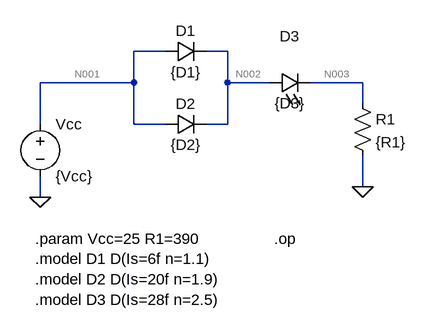
[diagram p0: schematic Lab 01 EaD C.asc]
Lab 01 EaD C.asc, the LTspice schematic file:
Version 4
SHEET 1 880 680
WIRE 144 16 96 16
WIRE 240 16 208 16
WIRE 96 64 96 16
WIRE 96 64 -48 64
WIRE 240 64 240 16
WIRE 304 64 240 64
WIRE 448 64 368 64
WIRE 448 96 448 64
WIRE -48 128 -48 64
WIRE 96 128 96 64
WIRE 144 128 96 128
WIRE 240 128 240 64
WIRE 240 128 208 128
WIRE 448 224 448 176
WIRE -48 240 -48 208
FLAG -48 240 0
FLAG 448 224 0
SYMBOL voltage -48 112 R0
SYMATTR InstName Vcc
SYMATTR Value {Vcc}
SYMBOL diode 144 32 R270
WINDOW 0 32 32 VTop 2
WINDOW 3 0 32 VBottom 2
SYMATTR InstName D1
SYMATTR Value {D1}
SYMBOL diode 144 144 R270
WINDOW 0 32 32 VTop 2
WINDOW 3 0 32 VBottom 2
SYMATTR InstName D2
SYMATTR Value {D2}
SYMBOL LED 304 80 R270
WINDOW 0 72 32 VTop 2
WINDOW 3 0 32 VBottom 2
SYMATTR InstName D3
SYMATTR Value {D3}
SYMBOL res 432 80 R0
SYMATTR InstName R1
SYMATTR Value {R1}
TEXT -56 304 Left 2 !.param Vcc=25 R1=390\n.model D1 D(Is=6f n=1.1)\n.model D2 D(Is=20f n=1.9)\n.model D3 D(Is=28f n=2.5)
TEXT 312 304 Left 2 !.op

The netlist it stands for:
* Lab 01 EaD C.asc
Vcc N001 0 {Vcc}
D1 N001 N002 {D1}
D2 N001 N002 {D2}
D3 N002 N003 {D3}
R1 N003 0 {R1}
.model D D
.lib standard.dio
.param Vcc=25 R1=390
.model D1 D(Is=6f n=1.1)
.model D2 D(Is=20f n=1.9)
.model D3 D(Is=28f n=2.5)
.op
.backanno
.end

* Results of the author's LTspice run, read from the files saved beside the schematic
* Operating Point:
*   V(n001) = 25 V
*   V(n002) = 24.15 V
*   V(n003) = 22.32 V
*   I(D3) = 57.22 mA
*   I(D2) = 653.8 nA
*   I(D1) = 57.22 mA
*   I(R1) = 57.22 mA
*   I(Vcc) = -57.22 mA
* From the log:
*   Semiconductor Device Operating Points:
*                           --- Diodes ---
*   Name:      d3          d2          d1
*   Model:     d3          d2          d1
*   Id:      5.72e-02    6.54e-07    5.72e-02
*   Vd:      1.83e+00    8.50e-01    8.50e-01
*   Req:     1.13e+00    7.52e+04    4.97e-01
*   CAP:     0.00e+00    0.00e+00    0.00e+00